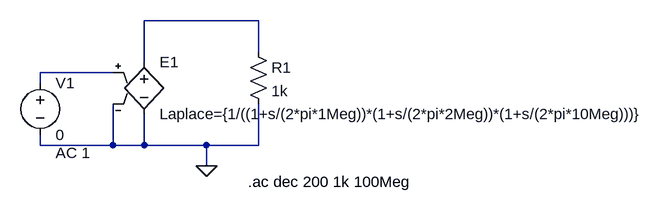
[diagram p0: schematic Estabilidad-Laplace.asc]
Estabilidad-Laplace.asc, the LTspice schematic file:
Version 4.1
SHEET 1 1252 680
WIRE 368 48 192 48
WIRE 368 96 368 48
WIRE 192 112 192 48
WIRE 144 128 32 128
WIRE 32 144 32 128
WIRE 32 240 32 224
WIRE 144 240 144 176
WIRE 144 240 32 240
WIRE 192 240 192 192
WIRE 192 240 144 240
WIRE 288 240 192 240
WIRE 368 240 368 176
WIRE 368 240 288 240
WIRE 288 272 288 240
FLAG 288 272 0
SYMBOL e 192 96 R0
SYMATTR InstName E1
SYMATTR Value Laplace={1/((1+s/(2*pi*1Meg))*(1+s/(2*pi*2Meg))*(1+s/(2*pi*10Meg)))}
SYMBOL res 352 80 R0
SYMATTR InstName R1
SYMATTR Value 1k
SYMBOL voltage 32 128 R0
WINDOW 123 24 124 Left 2
WINDOW 39 0 0 Left 0
SYMATTR Value2 AC 1
SYMATTR InstName V1
SYMATTR Value 0
TEXT 352 296 Left 2 !.ac dec 200 1k 100Meg

The netlist it stands for:
* Estabilidad-Laplace.asc
E1 N001 0 N002 0 Laplace={1/((1+s/(2*pi*1Meg))*(1+s/(2*pi*2Meg))*(1+s/(2*pi*10Meg)))}
R1 N001 0 1k
V1 N002 0 0 AC 1
.ac dec 200 1k 100Meg
.backanno
.end